# EAGLE design proto-bike-light (EAGLE 7.3.0)
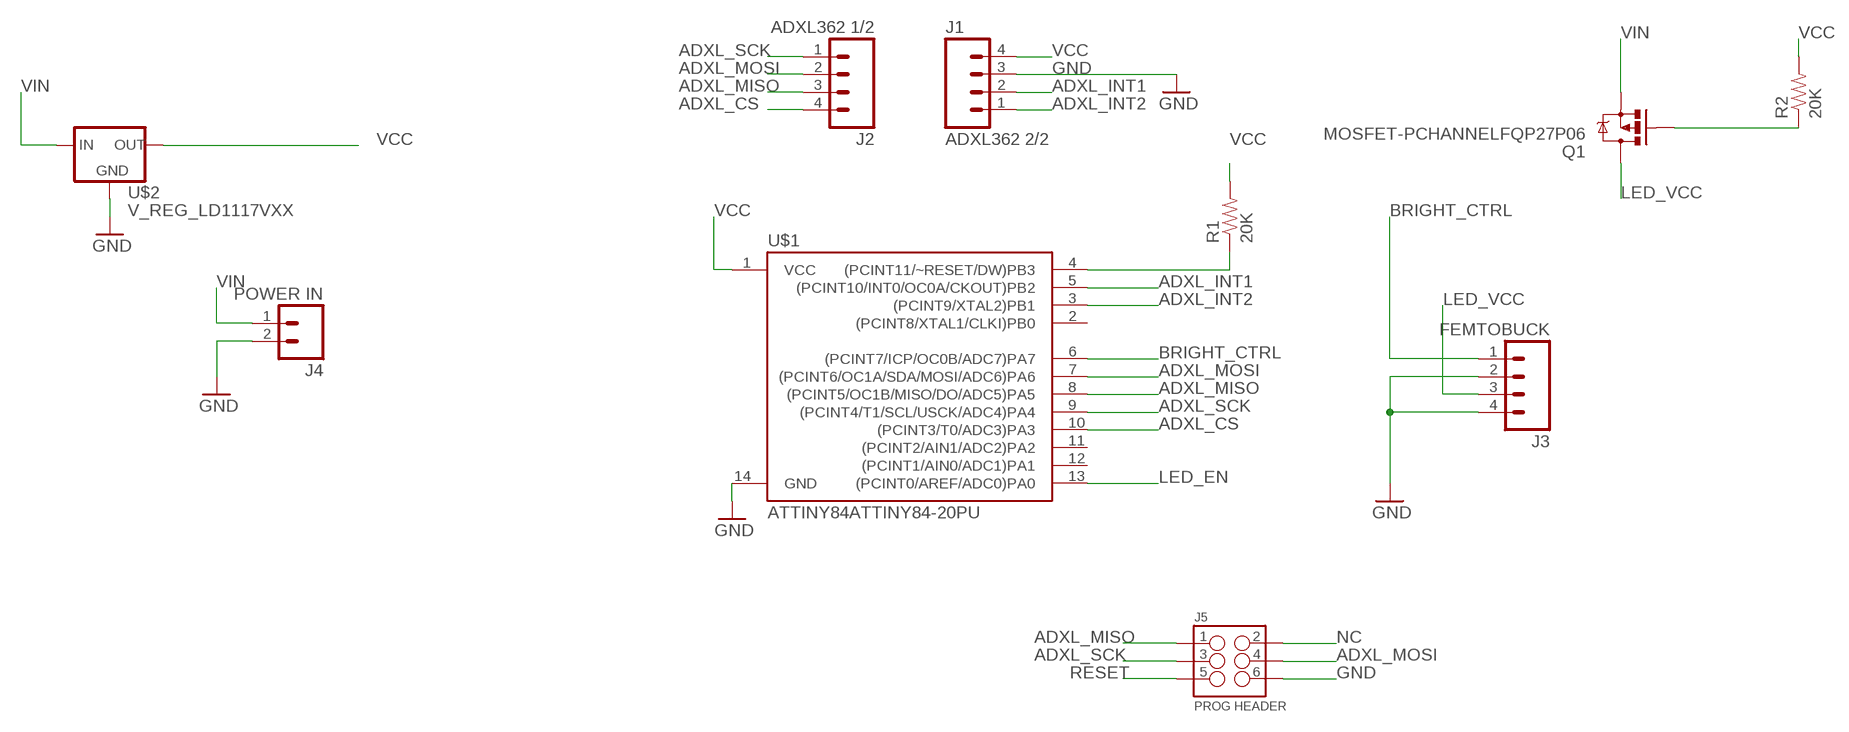
[diagram p0: schematic, sheet 1]

## Parts
J1  ADXL362 2/2  M04PTH  [1X04]
J2  ADXL362 1/2  M04PTH  [1X04]
J3  FEMTOBUCK  M04PTH  [1X04]
J4  POWER IN  M02PTH  [1X02]
J5  PROG HEADER  M03X2FEMALE  [2X3]
Q1  MOSFET-PCHANNELFQP27P06  [TO220V]
R1  20K  RESISTORPTH-1/4W  [AXIAL-0.4]
R2  20K  RESISTORPTH-1/4W  [AXIAL-0.4]
U$1  ATTINY84ATTINY84-20PU  [DIL14]
U$2  V_REG_LD1117VXX  [78XXL]

## Nets
ADXL_CS: J2.4 U$1.10((PCINT3/T0/ADC3)PA3)
ADXL_INT1: J1.2 U$1.5((PCINT10/INT0/OC0A/CKOUT)PB2)
ADXL_INT2: J1.1 U$1.3((PCINT9/XTAL2)PB1)
ADXL_MISO: J2.3 J5.1 U$1.8((PCINT5/OC1B/MISO/DO/ADC5)PA5)
ADXL_MOSI: J2.2 J5.4 U$1.7((PCINT6/OC1A/SDA/MOSI/ADC6)PA6)
ADXL_SCK: J2.1 J5.3 U$1.9((PCINT4/T1/SCL/USCK/ADC4)PA4)
BRIGHT_CTRL: J3.1 U$1.6((PCINT7/ICP/OC0B/ADC7)PA7)
GND: J1.3 J3.2 J3.4 J4.2 J5.6 U$1.14(GND) U$2.IN(GND)
LED_EN: Q1.1(G) R2.P$1 U$1.13((PCINT0/AREF/ADC0)PA0)
LED_VCC: J3.3 Q1.2(D)
NC: J5.2
RESET: J5.5 R1.P$1 U$1.4((PCINT11/~RESET/DW)PB3)
VCC: J1.4 R1.P$2 R2.P$2 U$1.1(VCC) U$2.GND(OUT)
VIN: J4.1 Q1.3(S) U$2.OUT(IN)
Unconnected: U$1.2((PCINT8/XTAL1/CLKI)PB0) U$1.11((PCINT2/AIN1/ADC2)PA2) U$1.12((PCINT1/AIN0/ADC1)PA1)

## Library data of the parts
J1-J3 = SparkFun-Connectors:M04: Header 4 Standard 4-pin 0.1" header. Use with straight break away headers (SKU : PRT-00116), right angle break away headers (PRT-00553), swiss pins (PRT-00743), machine pins (PRT-00117), and female headers (PRT-00115). Molex polarized connector foot print use with SKU : PRT-08231 with associated crimp pins and housings. 1MM SMD Version SKU: PRT-10208; PROD_ID: CONN-09696
J4 = SparkFun-Connectors:M02: Standard 2-pin 0.1" header. Use with - straight break away headers ( PRT-00116) - right angle break away headers (PRT-00553) - swiss pins (PRT-00743) - machine pins (PRT-00117) - female headers (PRT-00115) Molex polarized connector foot print use with: PRT-08233 with associated crimp pins and housings. 2.54_SCREWTERM for use with PRT-10571. 3.5mm Screw Terminal footprints for PRT-08084 5mm Screw Terminal footprints for use with PRT-08432
J5 = SparkFun-Connectors:M03X2: 2x3 .1" header. Shrouded, with keying- CONN-10681 SMT- CONN-11415 Pogo pins- HW-11044; PROD_ID: CONN-11566; VALUE: FEMALE 2x3
Q1 = SparkFun-DiscreteSemi:MOSFET-PCHANNEL: Generic PMOSFET IRLML2244 - TRANS-11153 (SOT-23 -20V -4.3A) (1.Gate 2.Source 3.Drain) FQP27P06 - COM-10349 <http://www.sparkfun.com/products/10349> (TO-220 -60V -27A) (1.Gate 2.Source 3.Drain)
R1 R2 = SparkFun-Resistors:RESISTOR: Resistor Basic schematic elements and footprints for 0603, 1206, and PTH resistors.
U$1 = SparkFun-DigitalIC:ATTINY84: Atmel 14-pin 2/4/8kB flash uC
U$2 = SparkFun-PowerIC:V_REG_LD1117VXX: LD1117VXX voltage regulator. We carry the 3.3V version (COM-00526) in TO-220 package.

## Board
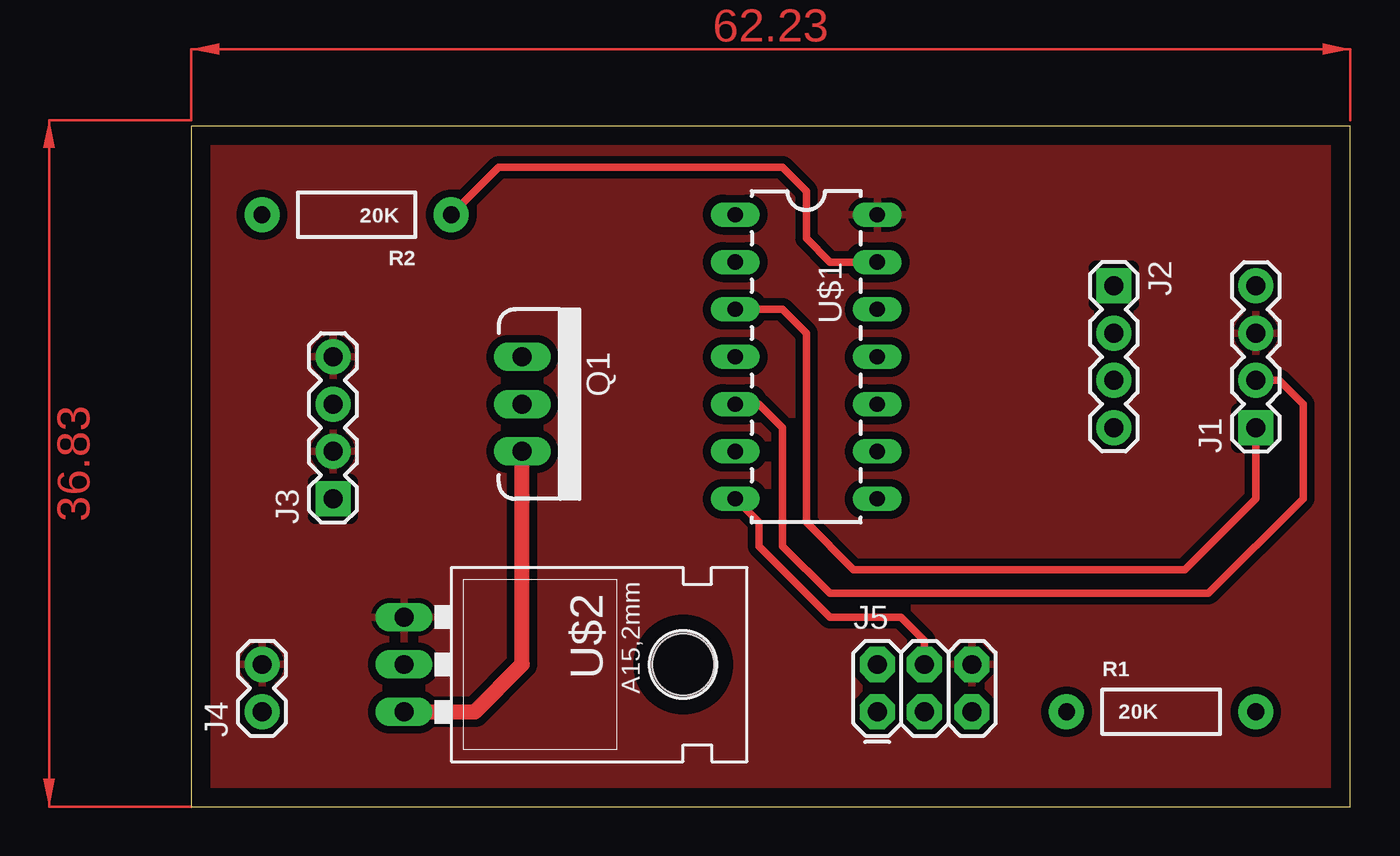
[diagram p1: board, top side]
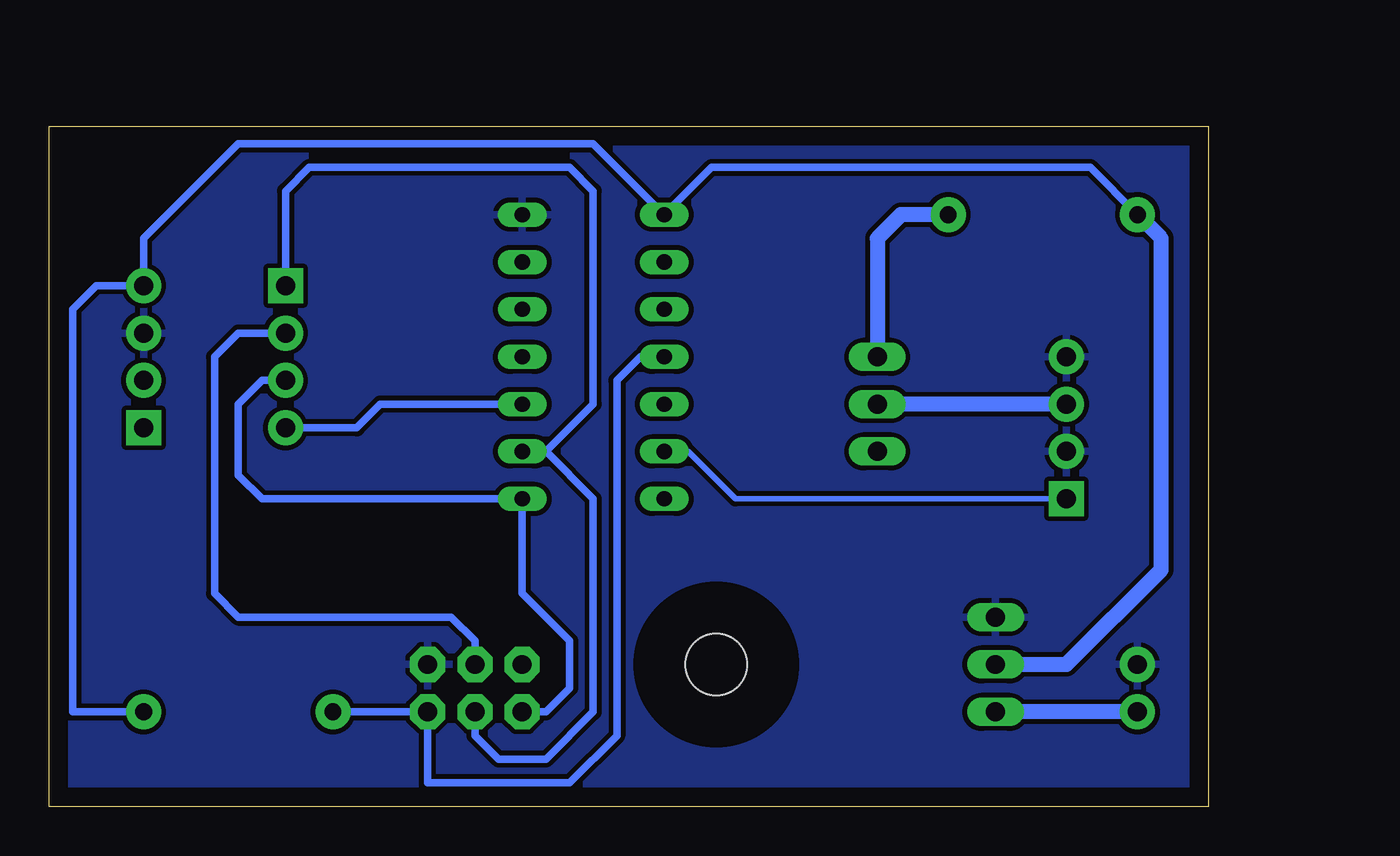
[diagram p2: board, bottom side, seen from below]

Size 62.21 x 36.5 mm. Coordinates in mm from the lower left corner, seen from the top.
Outline: 0,0 62.21,0 62.21,36.5 0,36.5 0,0
Copper layers (1*16): Top 0.035mm / dielectric 1.5mm / Bottom 0.035mm
Design rules "default": minimum track width 10mil, minimum drill 24mil, track to track 8mil, track to pad 8mil, pad to pad 8mil, via to via 8mil, smd to smd 8mil, copper to edge 40mil, drill to drill 8mil, minimum pad ring 10mil, minimum via ring 8mil, stop-mask expansion 4mil, vias tented up to drill 0mil, thermal gap 10mil

### Footprints (pad centres in the part's own frame; a part is rotated, then mirrored left to right if it is on the bottom)
1X04 = drill 1.016 pad 1.88 square: 1 0,0 | drill 1.016 pad 1.88: 2 2.54,0; 3 5.08,0; 4 7.62,0
1X02 = drill 1.016 pad 1.88: 1 0,0; 2 2.54,0
2X3 = drill 1.016 pad 1.88 octagon: 1 0,0; 2 0,2.54; 3 2.54,0; 4 2.54,2.54; 5 5.08,0; 6 5.08,2.54
TO220V = drill 1.016 long: 1 -2.54,0; 2 0,0; 3 2.54,0
AXIAL-0.4 = drill 0.9 pad 1.88: P$1 -5.08,0; P$2 5.08,0
DIL14 = drill 0.813 long: 1 -8.89,-3.81; 2 -6.35,-3.81; 3 -3.81,-3.81; 4 -1.27,-3.81; 5 1.27,-3.81; 6 3.81,-3.81; 7 6.35,-3.81; 8 6.35,3.81; 9 3.81,3.81; 10 1.27,3.81; 11 -1.27,3.81; 12 -3.81,3.81; 13 -6.35,3.81; 14 -8.89,3.81
78XXL = drill 1.016 long: GND 0,-3.81; IN -2.54,-3.81; OUT 2.54,-3.81 | hole 3.302: 0,11.176

### Placement (x,y rotation side)
J1  57.15,20.32 90 top
J2  49.53,27.94 270 top
J3  7.62,16.51 90 top
J4  3.81,5.08 90 top
J5  36.83,5.08 0 top
Q1  17.78,21.59 270 top
R1  52.07,5.08 0 top
R2  8.89,31.75 180 top
U$1  33.02,22.86 270 top
U$2  15.24,7.62 270 top

### Tracks (layer width: path | path; a pad name or v marks a point on that pad's centre or on a via)
ADXL_CS
  Bottom 0.406: U$1.10 44.45,21.59 45.72,20.32 J2.4
ADXL_INT1
  Top 0.406: U$1.5 30.48,21.59 31.75,20.32 31.75,13.97 34.29,11.43 54.61,11.43 59.69,16.51 59.69,21.59 58.42,22.86 J1.2
ADXL_INT2
  Top 0.406: J1.1 57.15,16.51 53.34,12.7 35.56,12.7 33.02,15.24 33.02,25.4 31.75,26.67 U$1.3
ADXL_MISO
  Bottom 0.406: J5.1 35.56,5.08 34.29,6.35 34.29,8.89 36.83,11.43 U$1.8 50.8,16.51 52.07,17.78 52.07,21.59 50.8,22.86 J2.3
ADXL_MOSI
  Top 0.406: U$1.7 30.48,15.24 30.48,13.97 34.29,10.16 38.1,10.16 39.37,8.89 J5.4
  Bottom 0.406: J2.2 52.07,25.4 53.34,24.13 53.34,11.43 52.07,10.16 40.64,10.16 39.37,8.89 J5.4
ADXL_SCK
  Bottom 0.406: 35.56,19.05 33.02,21.59 33.02,33.02 34.29,34.29 48.26,34.29 49.53,33.02 J2.1 | U$1.9 35.56,19.05 | 35.56,19.05 33.02,16.51 33.02,5.08 35.56,2.54 38.1,2.54 39.37,3.81 J5.3
BRIGHT_CTRL
  Bottom 0.305: J3.1 25.4,16.51 27.94,19.05 U$1.6
GND
  pour Bottom (isolate 0.254): 0,36.83 0,0 62.23,0 62.23,36.83
  pour Top (isolate 0.406): 0,0 0,36.83 62.23,36.83 62.23,0
LED_EN
  Top 0.406: U$1.13 34.29,29.21 33.02,30.48 33.02,33.02 31.75,34.29 16.51,34.29 R2.P$1
  Bottom 0.813: R2.P$1 16.51,31.75 17.78,30.48 Q1.1
LED_VCC
  Bottom 0.813: J3.3 Q1.2
RESET
  Bottom 0.406: R1.P$1 J5.5 41.91,1.27 34.29,1.27 31.75,3.81 31.75,22.86 30.48,24.13 U$1.4
VCC
  Bottom 0.406: R2.P$2 6.35,34.29 26.67,34.29 U$1.1 33.02,35.56 52.07,35.56 57.15,30.48 J1.4 59.69,27.94 60.96,26.67 60.96,5.08 R1.P$2
  Bottom 0.813: U$2.GND 7.62,7.62 2.54,12.7 2.54,30.48 R2.P$2
VIN
  Top 0.813: U$2.OUT 15.24,5.08 17.78,7.62 Q1.3
  Bottom 0.813: J4.1 U$2.OUT
(copper drawn outside any net)
  shapes: Top area x2